# Altium schematic sheet Storage.SchDoc
size 594 x 420 mm
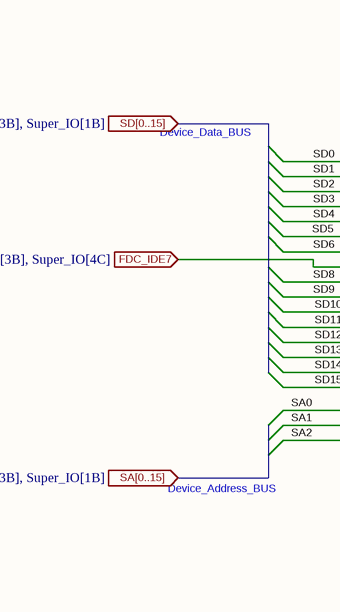
[diagram p0: Storage.SchDoc, top left]
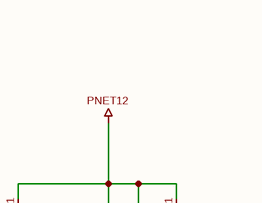
[diagram p1: Storage.SchDoc, top middle]
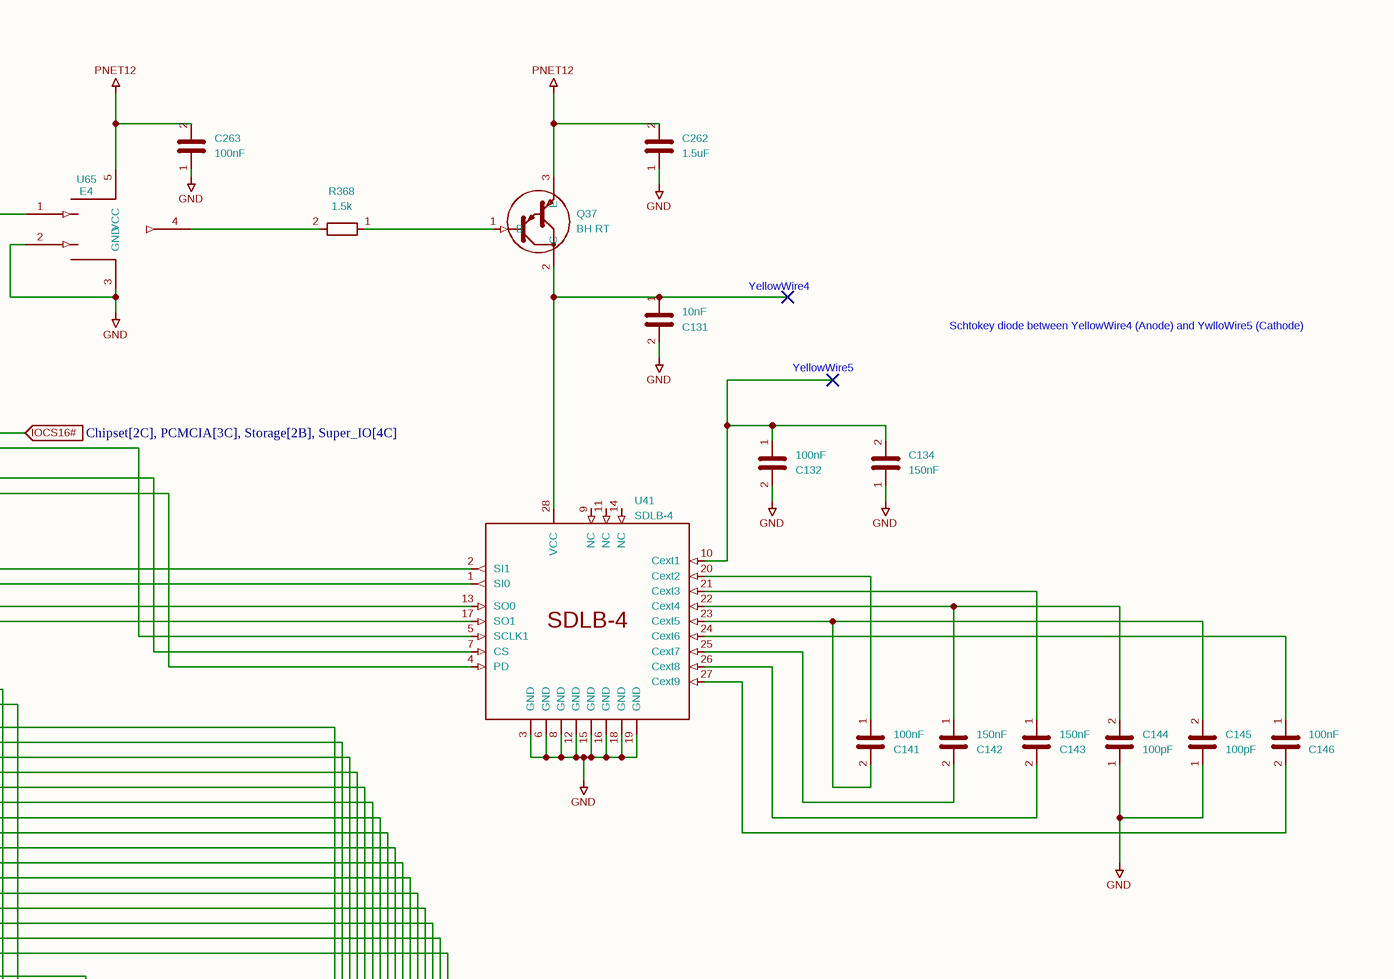
[diagram p2: Storage.SchDoc, top right]
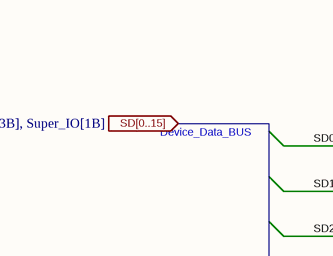
[diagram p3: Storage.SchDoc, bottom left]
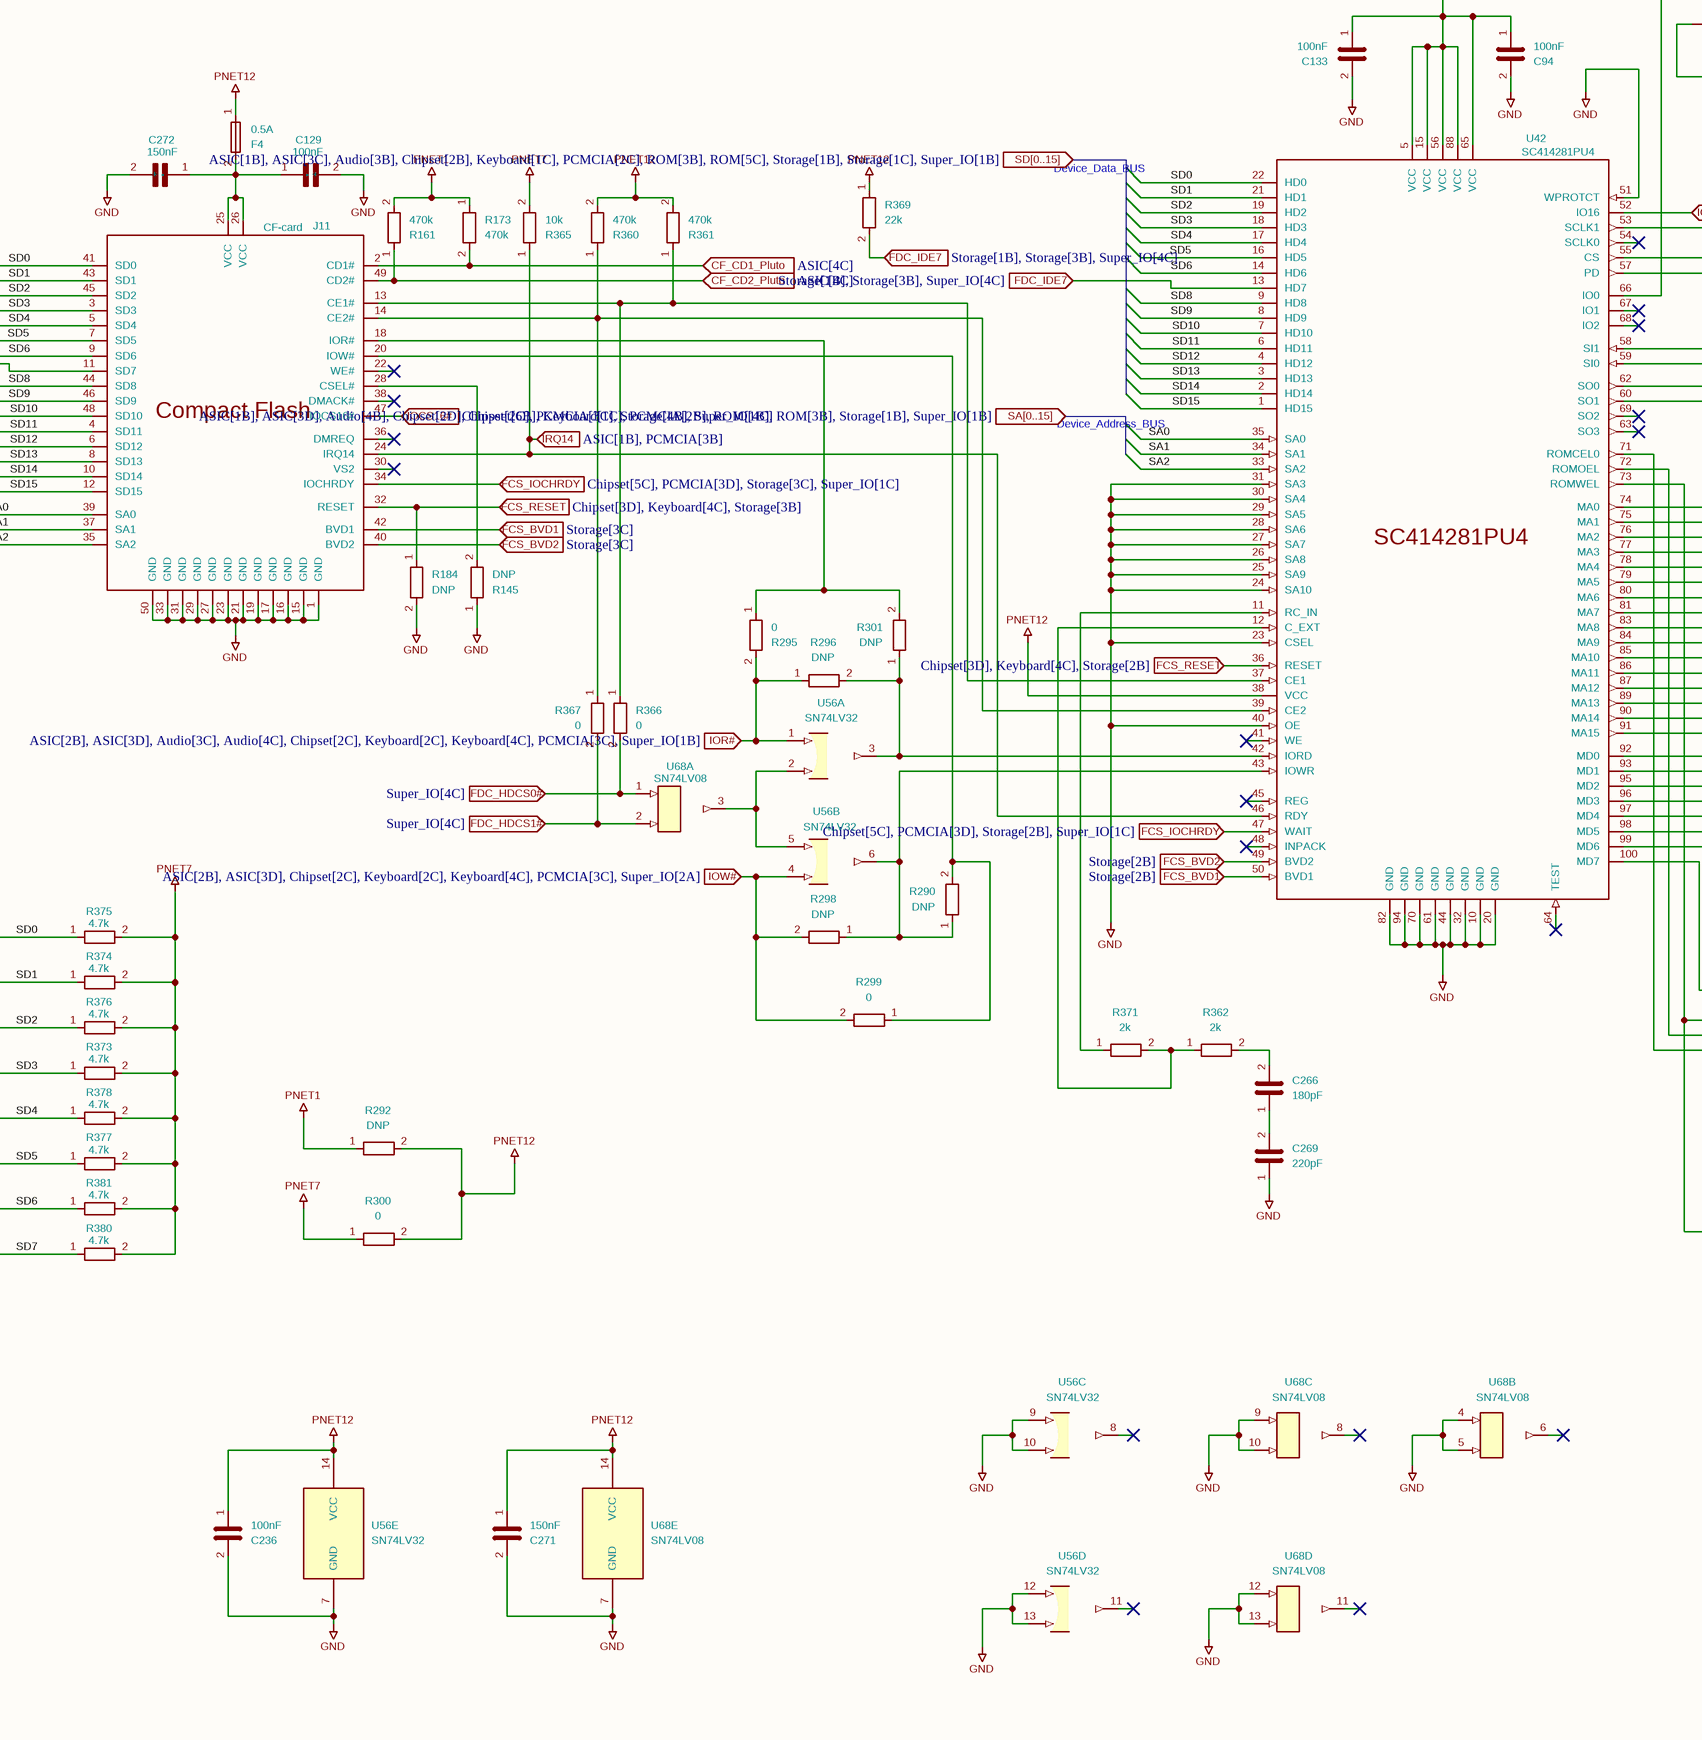
[diagram p4: Storage.SchDoc, bottom middle]
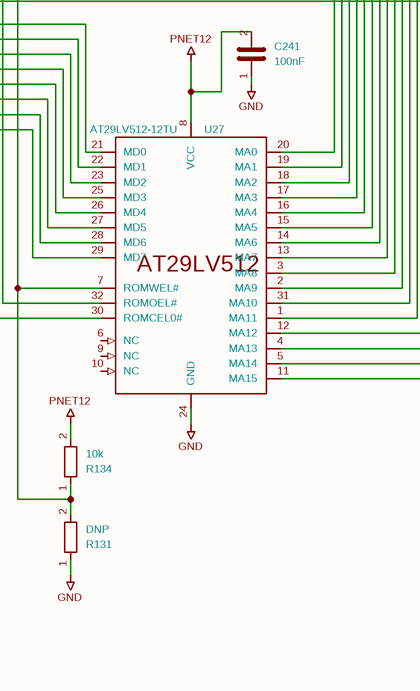
[diagram p5: Storage.SchDoc, bottom right]

## Parts
C94  100nF  [C_0402_1005Metric]
C129  100nF  [C_0402_1005Metric]
C131  10nF  [C_0603_1608Metric]
C132  100nF  [C_0603_1608Metric]
C133  100nF  [C_0402_1005Metric]
C134  150nF  [C_0603_1608Metric]
C141  100nF  [C_0402_1005Metric]
C142  150nF  [C_0402_1005Metric]
C143  150nF  [C_0402_1005Metric]
C144  100pF  [C_0402_1005Metric]
C145  100pF  [C_0402_1005Metric]
C146  100nF  [C_0402_1005Metric]
C236  100nF  [C_0402_1005Metric]
C241  100nF  [C_0402_1005Metric]
C262  1.5uF  [C_0805_2012Metric]
C263  100nF  [C_0402_1005Metric]
C266  180pF  [C_0402_1005Metric]
C269  220pF  [C_0402_1005Metric]
C271  150nF  [C_0402_1005Metric]
C272  150nF  [C_0402_1005Metric]
F4  0.5A  [Fuse_1206_3216Metric]
J11  CF-card  [CF-card]
Q37  BH RT  [SOT-89-3]
R131  DNP  [R_0402_1005Metric]
R134  10k  [R_0402_1005Metric]
R145  DNP  [R_0402_1005Metric]
R161  470k  [R_0402_1005Metric]
R173  470k  [R_0402_1005Metric]
R184  DNP  [R_0402_1005Metric]
R290  DNP  [R_0402_1005Metric]
R292  DNP  [R_0805_2012Metric]
R295  0  [R_0402_1005Metric]
R296  DNP  [R_0402_1005Metric]
R298  DNP  [R_0402_1005Metric]
R299  0  [R_0402_1005Metric]
R300  0  [R_0805_2012Metric]
R301  DNP  [R_0402_1005Metric]
R360  470k  [R_0402_1005Metric]
R361  470k  [R_0402_1005Metric]
R362  2k  [R_0402_1005Metric]
R365  10k  [R_0402_1005Metric]
R366  0  [R_0402_1005Metric]
R367  0  [R_0402_1005Metric]
R368  1.5k  [R_0402_1005Metric]
R369  22k  [R_0402_1005Metric]
R371  2k  [R_0402_1005Metric]
R373  4.7k  [R_0402_1005Metric]
R374  4.7k  [R_0402_1005Metric]
R375  4.7k  [R_0402_1005Metric]
R376  4.7k  [R_0402_1005Metric]
R377  4.7k  [R_0402_1005Metric]
R378  4.7k  [R_0402_1005Metric]
R380  4.7k  [R_0402_1005Metric]
R381  4.7k  [R_0402_1005Metric]
U27  AT29LV512-12TU  [Flash-32]
U41  SDLB-4  [SanDisk]
U42  SC414281PU4  [QFN-100]
U56  SN74LV32  [TSSOP-14_4.4x5mm_P0.65mm]  (parts A,B,C,D,E of 5)
U65  E4  [SOT-353]
U68  SN74LV08  [TSSOP-14_4.4x5mm_P0.65mm]  (parts A,B,C,D,E of 5)

## Ports
CF_CD1_Pluto (in, see ASIC[4C]), CF_CD2_Pluto (in, see ASIC[4C]), FCS_BVD1 (in, see Storage[2B]), FCS_BVD1 (in, see Storage[3C]), FCS_BVD2 (in, see Storage[2B]), FCS_BVD2 (in, see Storage[3C]), FCS_IOCHRDY (in, see Chipset[5C], PCMCIA[3D], Storage[2B], Super_IO[1C]), FCS_IOCHRDY (in, see Chipset[5C], PCMCIA[3D], Storage[3C], Super_IO[1C]), FCS_RESET (in, see Chipset[3D], Keyboard[4C], Storage[2B]), FCS_RESET (in, see Chipset[3D], Keyboard[4C], Storage[3B]), FDC_HDCS0# (in, see Super_IO[4C]), FDC_HDCS1# (in, see Super_IO[4C]), FDC_IDE7 (in, see Storage[1B], Storage[3B], Super_IO[4C]), FDC_IDE7 (in, see Storage[3B], Super_IO[4C]), IOCS16# (in, see Chipset[2C], PCMCIA[3C], Storage[2B], Super_IO[4C]), IOCS16# (in, see Chipset[2C], PCMCIA[3C], Storage[4B], Super_IO[4C]), IOR# (in, see ASIC[2B], ASIC[3D], Audio[3C], Audio[4C], Chipset[2C], Keyboard[2C], Keyboard[4C], PCMCIA[3C], Super_IO[1B]), IOW# (in, see ASIC[2B], ASIC[3D], Chipset[2C], Keyboard[2C], Keyboard[4C], PCMCIA[3C], Super_IO[2A]), IRQ14 (in, see ASIC[1B], PCMCIA[3B]), SA[0..15] (in, see ASIC[1B], ASIC[3D], Audio[4B], Chipset[2D], Chipset[6B], Keyboard[1C], PCMCIA[2B], ROM[1B], ROM[3B], Storage[1B], Super_IO[1B]), SA[0..15] (in, see ASIC[1B], ASIC[3D], Audio[4B], Chipset[2D], Chipset[6B], Keyboard[1C], PCMCIA[2B], ROM[1B], ROM[3B], Storage[3B], Super_IO[1B]), SD[0..15] (in, see ASIC[1B], ASIC[3C], Audio[3B], Chipset[2B], Keyboard[1C], PCMCIA[2C], ROM[3B], ROM[5C], Storage[1B], Storage[1C], Super_IO[1B]), SD[0..15] (in, see ASIC[1B], ASIC[3C], Audio[3B], Chipset[2B], Keyboard[1C], PCMCIA[2C], ROM[3B], ROM[5C], Storage[1B], Storage[3B], Super_IO[1B]), SD[0..15] (in, see ASIC[1B], ASIC[3C], Audio[3B], Chipset[2B], Keyboard[1C], PCMCIA[2C], ROM[3B], ROM[5C], Storage[1C], Storage[3B], Super_IO[1B])

## Nets
GND: C94.2 C129.2(-) C131.2 C132.2 C133.2 C134.1 C144.1 C145.1 C236.2 C241.1 C262.1 C263.1 C269.1 C271.2 C272.2(-) J11.1(GND) J11.15(GND) J11.16(GND) J11.17(GND) J11.19(GND) J11.21(GND) J11.23(GND) J11.27(GND) J11.29(GND) J11.31(GND) J11.33(GND) J11.50(GND) R131.1 R145.1 R184.2 U27.24(GND) U41.3(GND) U41.6(GND) U41.8(GND) U41.12(GND) U41.15(GND) U41.16(GND) U41.18(GND) U41.19(GND) U42.10(GND) U42.20(GND) U42.23(CSEL) U42.24(SA10) U42.25(SA9) U42.26(SA8) U42.27(SA7) U42.28(SA6) U42.29(SA5) U42.30(SA4) U42.31(SA3) U42.32(GND) U42.40(OE) U42.44(GND) U42.51(WPROTCT) U42.61(GND) U42.70(GND) U42.82(GND) U42.94(GND) U56.7(GND) U56.9 U56.10 U56.12 U56.13 U65.2 U65.3(GND) U68.4 U68.5 U68.7(GND) U68.9 U68.10 U68.12 U68.13
PNET1: R161.2 R173.1 R292.1
PNET7: R300.1 R365.2 R373.2 R374.2 R375.2 R376.2 R377.2 R378.2 R380.2 R381.2
PNET12: C94.1 C133.1 C236.1 C241.2 C262.2 C263.2 C271.1 F4.1 Q37.3(E) R134.2 R292.2 R300.2 R360.2 R361.2 R369.1 U27.8(VCC) U42.5(VCC) U42.15(VCC) U42.38(VCC) U42.56(VCC) U42.65(VCC) U42.88(VCC) U56.14(VCC) U65.5(VCC) U68.14(VCC)
CF_CD1_Pluto: J11.2(CD1#) R173.2 ; port CF_CD1_Pluto
CF_CD2_Pluto: J11.49(CD2#) R161.1 ; port CF_CD2_Pluto
FCS_BVD1: J11.42(BVD1) U42.50(BVD1) ; port FCS_BVD1
FCS_BVD2: J11.40(BVD2) U42.49(BVD2) ; port FCS_BVD2
FCS_IOCHRDY: J11.34(IOCHRDY) U42.47(WAIT) ; port FCS_IOCHRDY
FCS_RESET: J11.32(RESET) R184.1 U42.36(RESET) ; port FCS_RESET
FDC_HDCS0#: R366.2 U68.1 ; port FDC_HDCS0#
FDC_HDCS1#: R367.2 U68.2 ; port FDC_HDCS1#
FDC_IDE7: J11.11(SD7) R369.2 U42.13(HD7) ; port FDC_IDE7
IOCS16#: J11.47(IOCS16#) U42.52(IO16) ; port IOCS16#
IOR#: R295.2 R296.1 U56.1 ; port IOR#
IOW#: R298.2 R299.2 U56.4 ; port IOW#
IRQ14: J11.24(IRQ14) R365.1 U42.46(RDY) ; port IRQ14
SA0: J11.39(SA0) U42.35(SA0)
SA1: J11.37(SA1) U42.34(SA1)
SA2: J11.35(SA2) U42.33(SA2)
SD0: J11.41(SD0) R375.1 U42.22(HD0)
SD1: J11.43(SD1) R374.1 U42.21(HD1)
SD2: J11.45(SD2) R376.1 U42.19(HD2)
SD3: J11.3(SD3) R373.1 U42.18(HD3)
SD4: J11.5(SD4) R378.1 U42.17(HD4)
SD5: J11.7(SD5) R377.1 U42.16(HD5)
SD6: J11.9(SD6) R381.1 U42.14(HD6)
SD7: R380.1
SD8: J11.44(SD8) U42.9(HD8)
SD9: J11.46(SD9) U42.8(HD9)
SD10: J11.48(SD10) U42.7(HD10)
SD11: J11.4(SD11) U42.6(HD11)
SD12: J11.6(SD12) U42.4(HD12)
SD13: J11.8(SD13) U42.3(HD13)
SD14: J11.10(SD14) U42.2(HD14)
SD15: J11.12(SD15) U42.1(HD15)
NetC129_1: C129.1(+) C272.1(+) F4.2 J11.25(VCC) J11.26(VCC)
NetC131_1: C131.1 Q37.2(C) U41.28(VCC)
NetC132_1: C132.1 C134.2 U41.10(Cext1)
NetC141_1: C141.1 U41.20(Cext2)
NetC141_2: C141.2 C145.2 U41.23(Cext5)
NetC142_1: C142.1 C144.2 U41.22(Cext4)
NetC142_2: C142.2 U41.25(Cext7)
NetC143_1: C143.1 U41.21(Cext3)
NetC143_2: C143.2 U41.26(Cext8)
NetC146_1: C146.1 U41.24(Cext6)
NetC146_2: C146.2 U41.27(Cext9)
NetC266_1: C266.1 C269.2
NetC266_2: C266.2 R362.2
NetJ11_13: J11.13(CE1#) R361.1 R366.1 U42.37(CE1)
NetJ11_14: J11.14(CE2#) R360.1 R367.1 U42.39(CE2)
NetJ11_18: J11.18(IOR#) R295.1 R301.2
NetJ11_20: J11.20(IOW#) R290.2 R299.1
NetJ11_28: J11.28(CSEL#) R145.2
NetQ37_1: Q37.1(B) R368.1
NetR131_2: R131.2 R134.1 U27.7(ROMWEL#) U42.73(ROMWEL)
NetR290_1: R290.1 R298.1 U42.43(IOWR) U56.6
NetR296_2: R296.2 R301.1 U42.42(IORD) U56.3
NetR362_1: R362.1 R371.2 U42.12(C_EXT)
NetR368_2: R368.2 U65.4
NetR371_1: R371.1 U42.11(RC_IN)
NetU27_1: U27.1(MA11) U42.86(MA11)
NetU27_2: U27.2(MA9) U42.84(MA9)
NetU27_3: U27.3(MA8) U42.83(MA8)
NetU27_4: U27.4(MA13) U42.89(MA13)
NetU27_5: U27.5(MA14) U42.90(MA14)
NetU27_11: U27.11(MA15) U42.91(MA15)
NetU27_12: U27.12(MA12) U42.87(MA12)
NetU27_13: U27.13(MA7) U42.81(MA7)
NetU27_14: U27.14(MA6) U42.80(MA6)
NetU27_15: U27.15(MA5) U42.79(MA5)
NetU27_16: U27.16(MA4) U42.78(MA4)
NetU27_17: U27.17(MA3) U42.77(MA3)
NetU27_18: U27.18(MA2) U42.76(MA2)
NetU27_19: U27.19(MA1) U42.75(MA1)
NetU27_20: U27.20(MA0) U42.74(MA0)
NetU27_21: U27.21(MD0) U42.92(MD0)
NetU27_22: U27.22(MD1) U42.93(MD1)
NetU27_23: U27.23(MD2) U42.95(MD2)
NetU27_25: U27.25(MD3) U42.96(MD3)
NetU27_26: U27.26(MD4) U42.97(MD4)
NetU27_27: U27.27(MD5) U42.98(MD5)
NetU27_28: U27.28(MD6) U42.99(MD6)
NetU27_29: U27.29(MD7) U42.100(MD7)
NetU27_30: U27.30(ROMCEL0#) U42.71(ROMCEL0)
NetU27_31: U27.31(MA10) U42.85(MA10)
NetU27_32: U27.32(ROMOEL#) U42.72(ROMOEL)
NetU41_1: U41.1(SI0) U42.59(SI0)
NetU41_2: U41.2(SI1) U42.58(SI1)
NetU41_4: U41.4(PD) U42.57(PD)
NetU41_5: U41.5(SCLK1) U42.53(SCLK1)
NetU41_7: U41.7(CS) U42.55(CS)
NetU41_13: U41.13(SO0) U42.62(SO0)
NetU41_17: U41.17(SO1) U42.60(SO1)
NetU42_66: U42.66(IO0) U65.1
NetU56_2: U56.2 U56.5 U68.3

Not connected (* = marked no-connect by the designer): J11 22(WE#)* 30(VS2)* 36(DMREQ)* 38(DMACK#)*; U27 6(NC) 9(NC) 10(NC); U41 9(NC) 11(NC) 14(NC); U42 41(WE)* 45(REG)* 48(INPACK)* 54(SCLK0)* 63(SO3)* 64(TEST)* 67(IO1)* 68(IO2)* 69(SO2)*; U56 8* 11*; U68 6* 8* 11*

## Notes on the sheet
- YellowWire4
- Schtokey diode between YellowWire4 (Anode) and YwlloWire5 (Cathode)
- Device_Data_BUS
- YellowWire5
- Device_Address_BUS
- 1
- 2
- 3
- 4
- 5
- 6
- 7
- 8
- 9
- 10
- 11
- A
- B
- C
- D
- E
- F
- G
- H
- Title: PC110
- File: Storage.kicad_sch
- Sheet: /
- Recreated by: Ahmad Byagowi
- KiCad E.D.A.  kicad (5.1.4)-1
- Size: A2
- Date:
- Rev:
- Id: 1/1
- (in symbol CF_Conn) Compact Flash

## Library data of the parts
C94 C129 C131-C134 C141-C146 C236 C241 C262 C263 C266 C269 C271 C272 = C
  C94 C129 C133 C141 C146 C236 C241 C263: Value: 100nF; Footprint: Capacitor_SMD:C_0402_1005Metric
  C131: Value: 10nF; Footprint: Capacitor_SMD:C_0603_1608Metric
  C132: Value: 100nF; Footprint: Capacitor_SMD:C_0603_1608Metric
  C134: Value: 150nF; Footprint: Capacitor_SMD:C_0603_1608Metric
  C142 C143 C271 C272: Value: 150nF; Footprint: Capacitor_SMD:C_0402_1005Metric
  C144 C145: Value: 100pF; Footprint: Capacitor_SMD:C_0402_1005Metric
  C262: Value: 1.5uF; Footprint: Capacitor_SMD:C_0805_2012Metric
  C266: Value: 180pF; Footprint: Capacitor_SMD:C_0402_1005Metric
  C269: Value: 220pF; Footprint: Capacitor_SMD:C_0402_1005Metric
F4 = Fuse: Value: 0.5A; Footprint: Fuse:Fuse_1206_3216Metric
J11 = CF_Conn: Value: CF-card; Footprint: PC110:CF-card
Q37 = Q_PNP_Darlington_Generic_BCE: Value: BH RT; Footprint: Package_TO_SOT_SMD:SOT-89-3
R131 R134 R145 R161 R173 R184 R290 R292 R295 R296 R298-R301 R360-R362 R365-R369 R371 R373-R378 R380 R381 = R
  R131 R145 R184: Value: DNP; Footprint: PCM_Resistor_SMD_AKL:R_0402_1005Metric
  R134: Value: 10k; Footprint: PCM_Resistor_SMD_AKL:R_0402_1005Metric
  R161 R173: Value: 470k; Footprint: PCM_Resistor_SMD_AKL:R_0402_1005Metric
  R290 R296 R298 R301: Value: DNP; Footprint: Resistor_SMD:R_0402_1005Metric
  R292: Value: DNP; Footprint: Resistor_SMD:R_0805_2012Metric
  R295 R299 R366 R367: Value: 0; Footprint: Resistor_SMD:R_0402_1005Metric
  R300: Value: 0; Footprint: Resistor_SMD:R_0805_2012Metric
  R360 R361: Value: 470k; Footprint: Resistor_SMD:R_0402_1005Metric
  R362 R371: Value: 2k; Footprint: Resistor_SMD:R_0402_1005Metric
  R365: Value: 10k; Footprint: Resistor_SMD:R_0402_1005Metric
  R368: Value: 1.5k; Footprint: Resistor_SMD:R_0402_1005Metric
  R369: Value: 22k; Footprint: Resistor_SMD:R_0402_1005Metric
  R373-R378 R380 R381: Value: 4.7k; Footprint: Resistor_SMD:R_0402_1005Metric
U27 = AT29LV512: Value: AT29LV512-12TU; Footprint: PC110:Flash-32
U56 = 74LS32: Value: SN74LV32; Footprint: Package_SO:TSSOP-14_4.4x5mm_P0.65mm
U65 = 74AHC1G32: Value: E4; Footprint: PC110:SOT-353
U68 = 74LS08: Value: SN74LV08; Footprint: Package_SO:TSSOP-14_4.4x5mm_P0.65mm
U41 = SDLB-4: Value: SDLB-4; Footprint: PC110:SanDisk
U42 = SC414281PU4: Value: SC414281PU4; Footprint: PC110:QFN-100